# EAGLE design pcb (EAGLE 9.7.0)
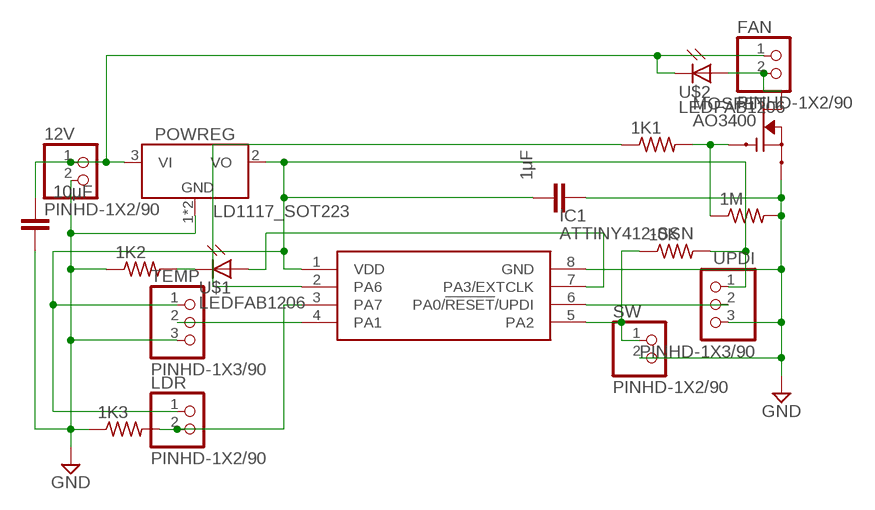
[diagram p0: schematic, sheet 1]

## Parts
1K1  R1206FAB  [R1206FAB]
1K2  R1206FAB  [R1206FAB]
1K3  R1206FAB  [R1206FAB]
1M  R1206FAB  [R1206FAB]
1μF  C_CHIP-1206(3216-METRIC)  [CAPC3216X135]
10K  R1206FAB  [R1206FAB]
10μF  C_CHIP-1206(3216-METRIC)  [CAPC3216X135]
12V  PINHD-1X2/90  [1X02/90]
FAN  PINHD-1X2/90  [1X02/90]
IC1  ATTINY412-SSN  [SOIC127P600X175-8N]
LDR  PINHD-1X2/90  [1X02/90]
MOSFET  AO3400  [SOT23]
POWREG  LD1117_SOT223  [SOT230P700X170-4]
SW  PINHD-1X2/90  [1X02/90]
TEMP  PINHD-1X3/90  [1X03/90]
U$1  LEDFAB1206  [LED1206FAB]
U$2  LEDFAB1206  [LED1206FAB]
UPDI  PINHD-1X3/90  [1X03/90]

## Nets
GND: 1K2.1 1K3.1 1M.2 1μF.2 10μF.2 12V.2 IC1.8(GND) MOSFET.2(S) POWREG.1(GND) POWREG.4(GND) SW.2 TEMP.3 UPDI.3
N$1: 1μF.1 10K.2 IC1.1(VDD) LDR.1 POWREG.2(VO) TEMP.1 UPDI.1
N$2: 10μF.1 12V.1 FAN.1 POWREG.3(VI) U$2.2(C)
N$3: IC1.6(PA0/!RESET!/UPDI) UPDI.2
N$4: 1K1.1 IC1.2(PA6)
N$5: 1K1.2 1M.1 MOSFET.1(G)
N$6: FAN.2 MOSFET.3(D) U$2.1(A)
N$7: IC1.7(PA3/EXTCLK) U$1.1(A)
N$8: 1K2.2 U$1.2(C)
N$9: IC1.4(PA1) TEMP.2
N$10: 1K3.2 IC1.3(PA7) LDR.2
N$11: 10K.1 IC1.5(PA2) SW.1

## Library data of the parts
1K1-1K3 1M 10K = fab:R: Resistor (US Symbol) Variants with postfix FAB are widened to allow the routing of internal traces
1μF 10μF = Capacitor:C: Capacitor - Generic; CATEGORY: Capacitor
12V FAN LDR SW = Connector:PINHD-1X2: PIN HEADER; CATEGORY: CONNECTOR; SUB-CATEGORY: PIN-HEADER
IC1 = ATTINY412-SSN:ATTINY412-SSN: 8-bit Microcontrollers - MCU 20MHz, 4KB, SOIC8, Ind 105C, Green, Tube Source: Datasheet <http://www.microchip.com/mymicrochip/filehandler.aspx?ddocname=en599382>; DESCRIPTION: 8-bit Microcontrollers - MCU 20MHz, 4KB, SOIC8, Ind 105C, Green, Tube; HEIGHT: 1.75mm; MANUFACTURER_NAME: Microchip; MANUFACTURER_PART_NUMBER: ATTINY412-SSN; MOUSER_PART_NUMBER: 579-ATTINY412-SSN; MOUSER_PRICE-STOCK: https://www.mouser.co.uk/ProductDetail/Microchip-Technology/ATTINY412-SSN?qs=3HJ2avRr9PItQG9ZsCamPQ%3D%3D
MOSFET = AO3400:AO3400; AVAILABILITY: Unavailable; DESCRIPTION: N-Channel 30V 5.8A _Ta_ 1.4W _Ta_ Surface Mount SOT-23-3; MF: Alpha &; MP: AO3400; PACKAGE: SOT-23-3 Alpha &amp; Omega Semiconductor; PRICE: None
POWREG = IC_Power-Management:LD1117: Adjustable and fixed positive voltage regulator Reference Datasheet <https://www.st.com/content/ccc/resource/technical/document/datasheet/99/3b/7d/91/91/51/4b/be/CD00000544.pdf/files/CD00000544.pdf/jcr:content/translations/en.CD00000544.pdf>; CATEGORY: IC_Linear; DESCRIPTION: Adjustable voltage regulator; MANUFACTURER: STMicroelectronics; MPN: Generic; SERIES: LM1117; SUB-CATEGORY: Voltage Regulator; TYPE: Linear
TEMP UPDI = Connector:PINHD-1X3: PIN HEADER; CATEGORY: CONNECTOR; SUB-CATEGORY: PIN-HEADER
U$1 U$2 = fab:LED: LED

## Board
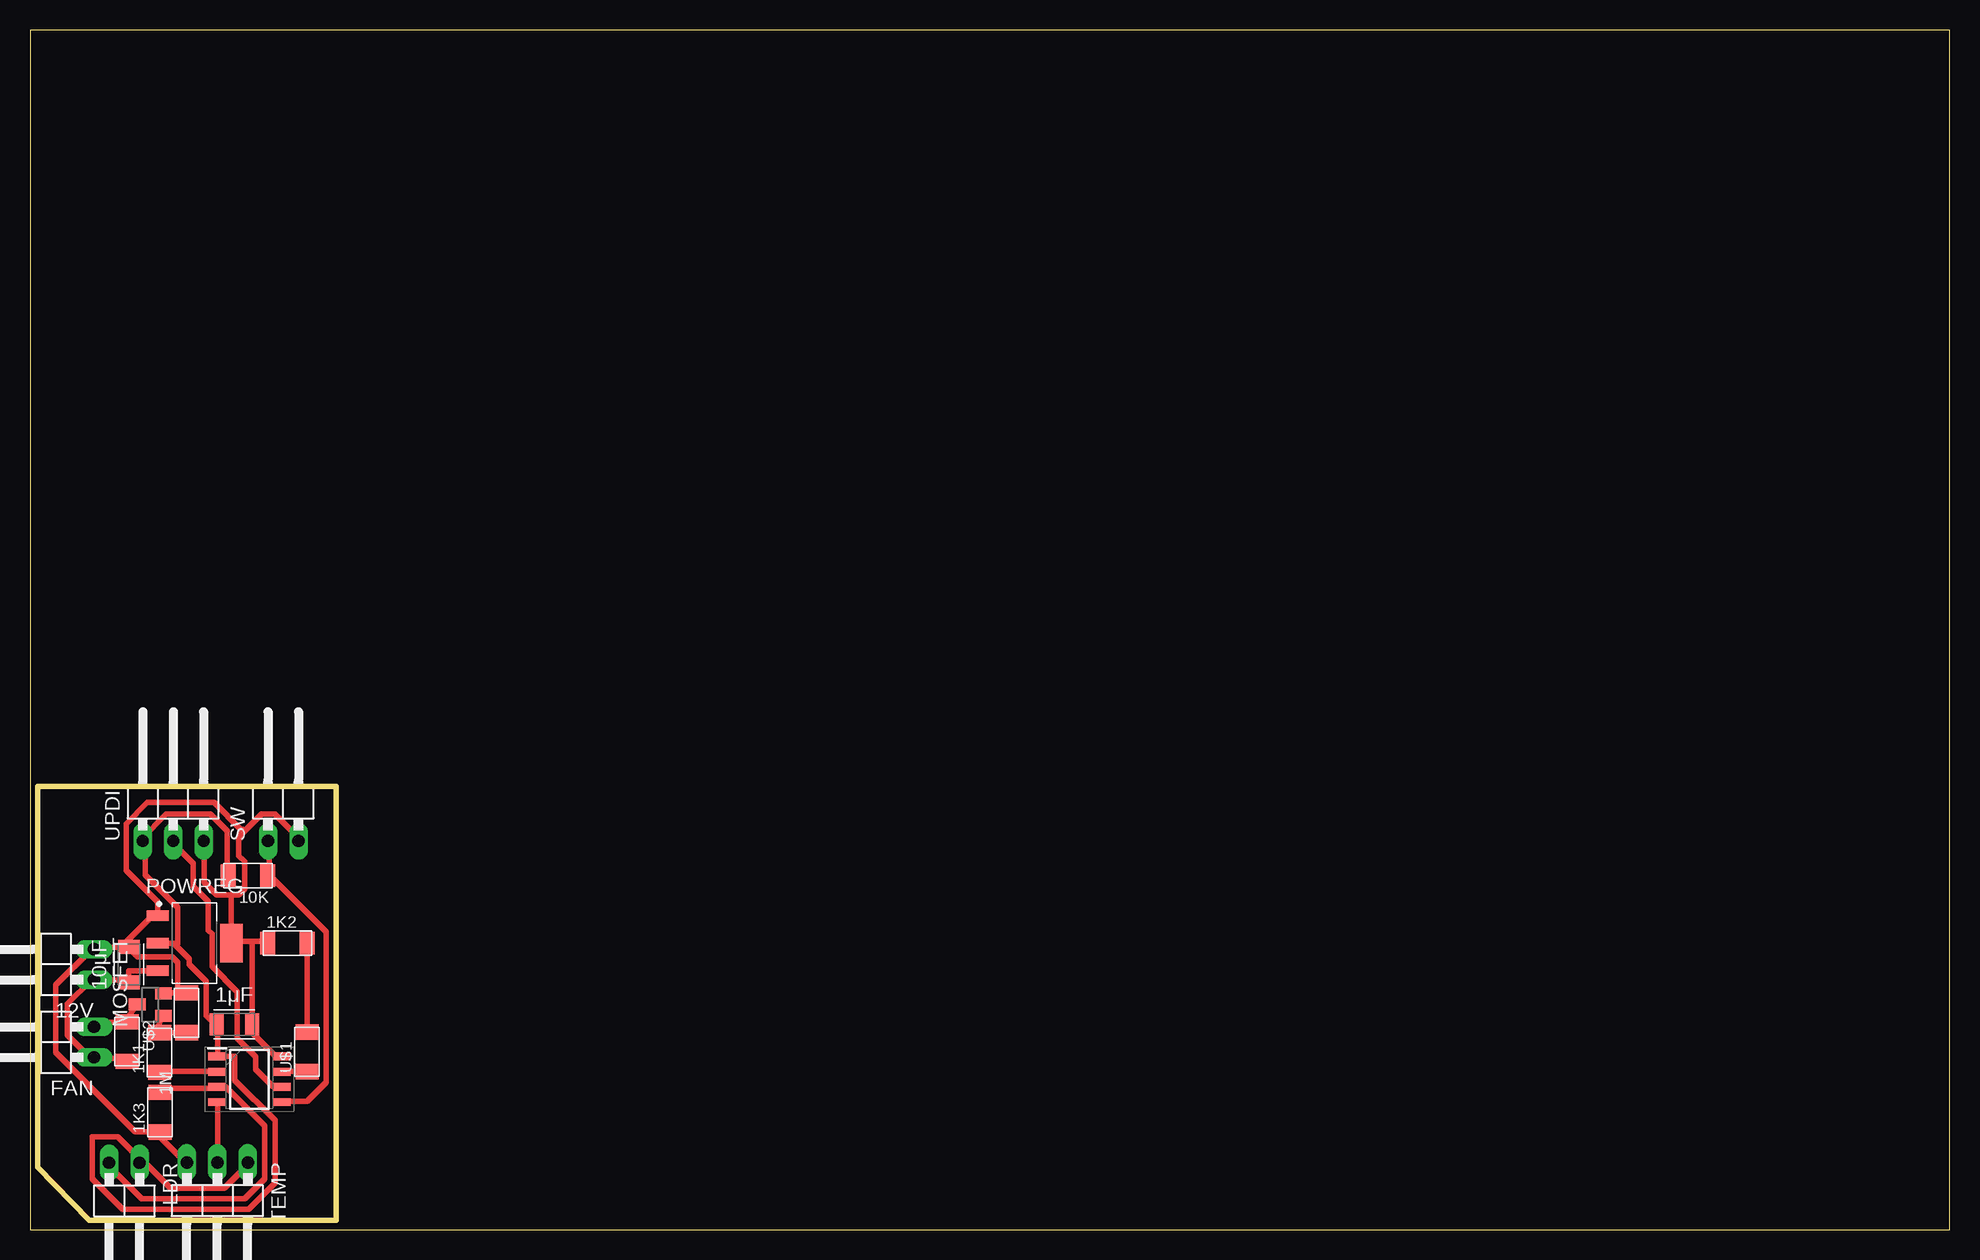
[diagram p1: board, top side]

Size 160 x 100 mm. Coordinates in mm from the lower left corner, seen from the top.
Outline: 0,0 160,0 160,100 0,100 0,0
Copper layers (1*16): Top / Bottom
Stack-up Default Layer Stack: Top User Defined 0.035mm / Dielectric-1 User Defined 1.5mm / Bottom User Defined 0.035mm
Design rules "default *": minimum track width 18mil, minimum drill 0.008890625mm, track to track 16mil, track to pad 16mil, pad to pad 16mil, via to via 12mil, smd to smd 10mil, copper to edge 40mil, drill to drill 6mil, minimum pad ring 10mil, minimum via ring 8mil, stop-mask expansion 4mil, vias tented up to drill 0mil, thermal gap 10mil
Milling: 5 lines

### Footprints (pad centres in the part's own frame; a part is rotated, then mirrored left to right if it is on the bottom)
R1206FAB = smd 1.27 x 1.905: 1 -1.651,0; 2 1.651,0
CAPC3216X135 = smd 1.165 x 1.815: 1 -1.475,0; 2 1.475,0
1X02/90 = drill 1.016 long: 1 -1.27,-3.81; 2 1.27,-3.81
SOIC127P600X175-8N = smd 1.5 x 0.65: 1 -2.7,1.905; 2 -2.7,0.635; 3 -2.7,-0.635; 4 -2.7,-1.905; 5 2.7,-1.905; 6 2.7,-0.635; 7 2.7,0.635; 8 2.7,1.905
SOT23 = smd 1 x 1.4: 1 -0.95,-1.1; 2 0.95,-1.1; 3 0,1.1
SOT230P700X170-4 = smd 1.86 x 0.898: 1 -3.075,2.3; 2 -3.075,0; 3 -3.075,-2.3 | smd 1.86 x 3.189: 4 3.075,0
1X03/90 = drill 1.016 long: 1 -2.54,-3.81; 2 0,-3.81; 3 2.54,-3.81
LED1206FAB = smd 1.27 x 1.905: 1 -1.651,0; 2 1.651,0

### Placement (x,y rotation side)
1K1  10.8,14.76 90 top
1K2  21.46,23.88 0 top
1K3  10.85,9.78 90 top
1M  13.05,18.07 90 top
1μF  17.03,17.11 0 top
10K  18.16,29.5 180 top
10μF  8.24,22.1 90 top
12V  1.52,22.1 90 top
FAN  1.52,15.62 90 top
IC1  18.29,12.52 0 top
LDR  7.86,1.75 180 top
MOSFET  10.03,18.75 90 top
POWREG  13.72,23.88 0 top
SW  21.11,36.2 0 top
TEMP  15.62,1.78 180 top
U$1  23.09,14.81 90 top
U$2  8.09,15.67 270 top
UPDI  11.94,36.2 0 top

### Tracks (layer width: path | path; a pad name or v marks a point on that pad's centre or on a via)
GND
  Top 0.457: IC1.8 20.47,14.43 18.5,16.39 1μF.2 18.51,17.34 18.51,24 | 18.51,24 16.92,24 POWREG.4 16.79,27.89 16.76,27.91 | 18.51,24 19.78,24 1K2.1 19.3,24.16 | UPDI.3 14.54,32.26 14.54,28.92 15.55,27.91 16.76,27.91 | 17.88,33.21 17.4,32.73 17.4,31.15 17.88,30.67 17.88,28.38 17.41,27.91 16.76,27.91 | 17.88,33.21 19.3,34.64 20.41,34.64 22.32,32.73 22.32,32.42 SW.2 | TEMP.3 12.95,5.59 10.89,7.65 10.89,8.13 1K3.1 10.82,8.16 8.79,8.16 2.16,14.79 2.16,20.39 5.14,23.37 12V.2 5.49,23.53 8.19,23.53 10μF.2 | MOSFET.2 11.21,19.72 12.95,19.72 1M.2 12.32,19.88 12.32,22.26 11.84,22.73 8.98,22.73 8.35,23.37 10μF.2 | 10μF.2 7.71,23.69 10.1,26.07 10.57,26.07 POWREG.1 10.64,27.32 8,29.96 8,33.81 9.78,35.59 15.34,35.59 17.56,33.37 17.72,33.37 17.88,33.21
N$1
  Top 0.457: 10K.2 16.45,29.56 16.45,33.21 15.02,34.64 11.37,34.64 9.3,32.58 9.46,32.42 UPDI.1 9.62,32.26 9.62,29.56 12.32,26.86 12.32,23.84 12.16,23.69 | 12.16,23.69 13.27,22.57 13.27,22.1 14.7,20.67 14.7,17.81 15.34,17.18 1μF.1 15.65,17.02 15.65,14.48 IC1.1 17.07,14.43 17.07,12.44 20.42,9.09 20.42,3.89 18.23,1.7 7.71,1.7 5.19,4.22 5.19,7.72 7.33,7.72 9.14,5.91 9.14,5.58 LDR.1 9.37,5.8 11.74,3.43 16.2,3.43 18.16,5.39 TEMP.1 | 12.16,23.69 12,23.84 10.73,23.84 POWREG.2
N$2
  Top 0.457: U$2.2 7.98,14.29 5.37,14.29 5.33,14.32 FAN.1 4.99,14.35 3.11,16.22 3.11,18.8 5.14,20.83 12V.1 5.37,20.8 8.05,20.8 10μF.1 8.24,21.58 POWREG.3
N$3
  Top 0.457: IC1.6 20.89,11.94 20.24,11.94 18.83,13.35 18.83,14.39 17.29,15.94 17.29,19.83 15.18,21.94 15.18,24.64 14.86,24.96 14.86,27.34 13.59,28.61 13.59,30.51 11.84,32.26 UPDI.2
N$4
  Top 0.457: IC1.2 15.49,13.21 10.89,13.21 1K1.1
N$5
  Top 0.457: 10.6,16.84 | 10.6,16.84 10.89,16.54 1K1.2 10.82,16.41 1M.1 | 10.6,16.84 MOSFET.1
N$6
  Top 0.457: 8.03,17.49 | 8.03,17.49 8.19,17.34 U$2.1 8.04,17.27 5.71,17.27 FAN.2 | 8.03,17.49 MOSFET.3
N$7
  Top 0.457: IC1.7 21.05,13.21 22.95,13.21 U$1.1
N$8
  Top 0.457: 1K2.2 23.11,16.54 U$1.2
N$9
  Top 0.457: IC1.4 15.65,10.51 15.65,5.59 TEMP.2
N$10
  Top 0.457: 1K3.2 10.89,11.46 11.21,11.78 15.49,11.78 IC1.3 16.3,11.89 19.56,8.62 19.56,4.25 17.88,2.56 9.31,2.56 6.6,5.27 6.6,5.43 LDR.2
N$11
  Top 0.457: IC1.5 21.05,10.67 23.09,10.67 24.68,12.26 24.68,24.82 19.94,29.56 10K.1 19.94,29.72 19.94,32.26 SW.1